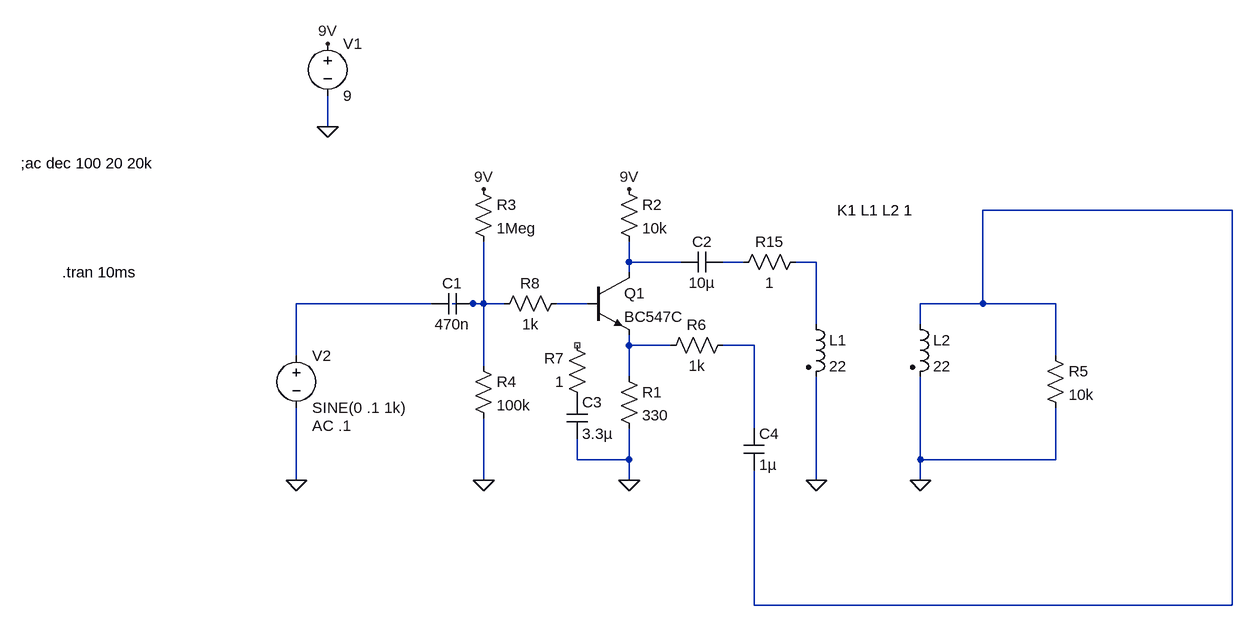
[diagram p0: schematic BJT_XFMR_Neg_Fdbk.asc]
BJT_XFMR_Neg_Fdbk.asc, the LTspice schematic file:
Version 4
SHEET 1 1456 680
WIRE -256 -96 -256 -144
WIRE 1136 32 752 32
WIRE 208 112 208 80
WIRE 288 112 208 112
WIRE 384 112 352 112
WIRE 496 112 464 112
WIRE 208 128 208 112
WIRE -96 176 -304 176
WIRE -32 176 -64 176
WIRE -16 176 -16 80
WIRE -16 176 -32 176
WIRE 16 176 -16 176
WIRE 144 176 96 176
WIRE 752 176 752 32
WIRE 752 176 656 176
WIRE 864 176 752 176
WIRE 496 208 496 112
WIRE 656 208 656 176
WIRE 208 240 208 224
WIRE 272 240 208 240
WIRE 400 240 352 240
WIRE -304 256 -304 176
WIRE 864 256 864 176
WIRE -16 272 -16 176
WIRE 208 288 208 240
WIRE 400 368 400 240
WIRE 128 416 128 384
WIRE 208 416 208 368
WIRE 208 416 128 416
WIRE 656 416 656 288
WIRE 864 416 864 336
WIRE 864 416 656 416
WIRE -304 448 -304 336
WIRE -16 448 -16 352
WIRE 208 448 208 416
WIRE 496 448 496 288
WIRE 656 448 656 416
WIRE 400 640 400 432
WIRE 1136 640 1136 32
WIRE 1136 640 400 640
FLAG -256 -96 0
FLAG -304 448 0
FLAG -16 448 0
FLAG 208 448 0
FLAG -256 -224 9V
FLAG -16 0 9V
FLAG 208 0 9V
FLAG 496 448 0
FLAG 656 448 0
DATAFLAG 208 112 ""
DATAFLAG 208 256 ""
SYMBOL npn 144 128 R0
SYMATTR InstName Q1
SYMATTR Value BC547C
SYMBOL res 192 272 R0
SYMATTR InstName R1
SYMATTR Value 330
SYMBOL res 192 -16 R0
SYMATTR InstName R2
SYMATTR Value 10k
SYMBOL res -32 -16 R0
SYMATTR InstName R3
SYMATTR Value 1Meg
SYMBOL res -32 256 R0
SYMATTR InstName R4
SYMATTR Value 100k
SYMBOL cap -32 160 R90
WINDOW 0 0 32 VBottom 2
WINDOW 3 32 32 VTop 2
SYMATTR InstName C1
SYMATTR Value 470n
SYMBOL cap 352 96 R90
WINDOW 0 0 32 VBottom 2
WINDOW 3 32 32 VTop 2
SYMATTR InstName C2
SYMATTR Value 10µ
SYMBOL voltage -256 -240 R0
WINDOW 123 0 0 Left 2
WINDOW 39 0 0 Left 2
SYMATTR InstName V1
SYMATTR Value 9
SYMBOL voltage -304 240 R0
WINDOW 123 24 124 Left 2
WINDOW 39 24 152 Left 2
SYMATTR Value2 AC .1
SYMATTR InstName V2
SYMATTR Value SINE(0 .1 1k)
SYMBOL res 112 160 R90
WINDOW 0 0 56 VBottom 2
WINDOW 3 32 56 VTop 2
SYMATTR InstName R8
SYMATTR Value 1k
SYMBOL ind2 480 192 R0
SYMATTR InstName L1
SYMATTR Value 22
SYMATTR Type ind
SYMATTR SpiceLine Rser=550
SYMBOL ind2 640 192 R0
SYMATTR InstName L2
SYMATTR Value 22
SYMATTR Type ind
SYMATTR SpiceLine Rser=550
SYMBOL res 480 96 R90
WINDOW 0 0 56 VBottom 2
WINDOW 3 32 56 VTop 2
SYMATTR InstName R15
SYMATTR Value 1
SYMBOL res 848 240 R0
SYMATTR InstName R5
SYMATTR Value 10k
SYMBOL res 368 224 R90
WINDOW 0 0 56 VBottom 2
WINDOW 3 32 56 VTop 2
SYMATTR InstName R6
SYMATTR Value 1k
SYMBOL cap 112 320 R0
SYMATTR InstName C3
SYMATTR Value 3.3µ
SYMBOL res 144 336 R180
WINDOW 0 36 76 Left 2
WINDOW 3 36 40 Left 2
SYMATTR InstName R7
SYMATTR Value 1
SYMBOL cap 384 368 R0
SYMATTR InstName C4
SYMATTR Value 1µ
TEXT -728 -40 Left 2 !;ac dec 100 20 20k
TEXT -664 128 Left 2 !.tran 10ms
TEXT 528 32 Left 2 !K1 L1 L2 1

The netlist it stands for:
* BJT_XFMR_Neg_Fdbk.asc
Q1 N002 N007 N008 0 BC547C
R1 N008 0 330
R2 9V N002 10k
R3 9V N006 1Meg
R4 N006 0 100k
C1 N006 N005 470n
C2 N003 N002 10µ
V1 9V 0 9
V2 N005 0 SINE(0 .1 1k) AC .1
R8 N007 N006 1k
L1 N004 0 22 Rser=550
L2 N001 0 22 Rser=550
R15 N004 N003 1
R5 N001 0 10k
R6 N009 N008 1k
C3 P001 0 3.3µ
R7 P001 NC_01 1
C4 N009 N001 1µ
.model NPN NPN
.model PNP PNP
.lib standard.bjt
;ac dec 100 20 20k
.tran 10ms
K1 L1 L2 1
.backanno
.end